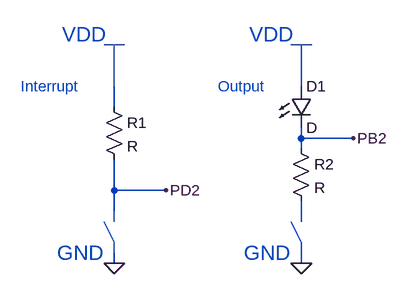
[diagram p0: schematic task1.asc]
task1.asc, the LTspice schematic file:
Version 4
SHEET 1 880 680
WIRE 208 -64 208 -80
WIRE -80 -48 -80 -80
WIRE 208 0 208 -16
WIRE 288 0 208 0
WIRE 208 16 208 0
WIRE -80 80 -80 32
WIRE 0 80 -80 80
WIRE -80 112 -80 80
WIRE 208 112 208 96
WIRE -80 192 -80 176
WIRE 208 192 208 176
FLAG -80 192 0
FLAG 0 80 PD2
FLAG 208 192 0
FLAG 288 0 PB2
SYMBOL LED 192 -80 R0
SYMATTR InstName D1
SYMBOL res -96 -64 R0
SYMATTR InstName R1
SYMBOL res 192 0 R0
SYMATTR InstName R2
TEXT -160 -160 Left 3 ;VDD
TEXT -168 176 Left 3 ;GND
TEXT 128 -160 Left 3 ;VDD
TEXT 120 176 Left 3 ;GND
TEXT -224 -80 Left 2 ;Interrupt
TEXT 80 -80 Left 2 ;Output
LINE Normal -80 -144 -80 -80
LINE Normal -96 -144 -80 -144
LINE Normal -64 -144 -96 -144
LINE Normal -64 -144 -64 -144 2
LINE Normal -64 -144 -64 -144 2
LINE Normal -80 128 -80 112
LINE Normal -80 128 -80 128 2
LINE Normal -80 128 -80 128 2
LINE Normal -80 160 -80 176
LINE Normal -80 160 -80 160 2
LINE Normal -96 128 -80 160
LINE Normal -96 128 -96 128 2
LINE Normal -96 128 -96 128 2
LINE Normal 208 -144 208 -80
LINE Normal 192 -144 208 -144
LINE Normal 224 -144 192 -144
LINE Normal 224 -144 224 -144 2
LINE Normal 224 -144 224 -144 2
LINE Normal 208 128 208 112
LINE Normal 208 128 208 128 2
LINE Normal 208 128 208 128 2
LINE Normal 208 160 208 176
LINE Normal 208 160 208 160 2
LINE Normal 192 128 208 160
LINE Normal 192 128 192 128 2
LINE Normal 192 128 192 128 2

The netlist it stands for:
* task1.asc
D1 N001 PB2 D
R1 N002 PD2 R
R2 PB2 N003 R
.model D D
.lib standard.dio
* VDD
* GND
* VDD
* GND
* Interrupt
* Output
.backanno
.end